# Altium schematic sheet ACD_SPD01_SPDHarness.SchDoc
size Letter; DocumentNumber: ACD_SPD01_SPDHarness; SheetNumber: 1; SheetTotal: 1
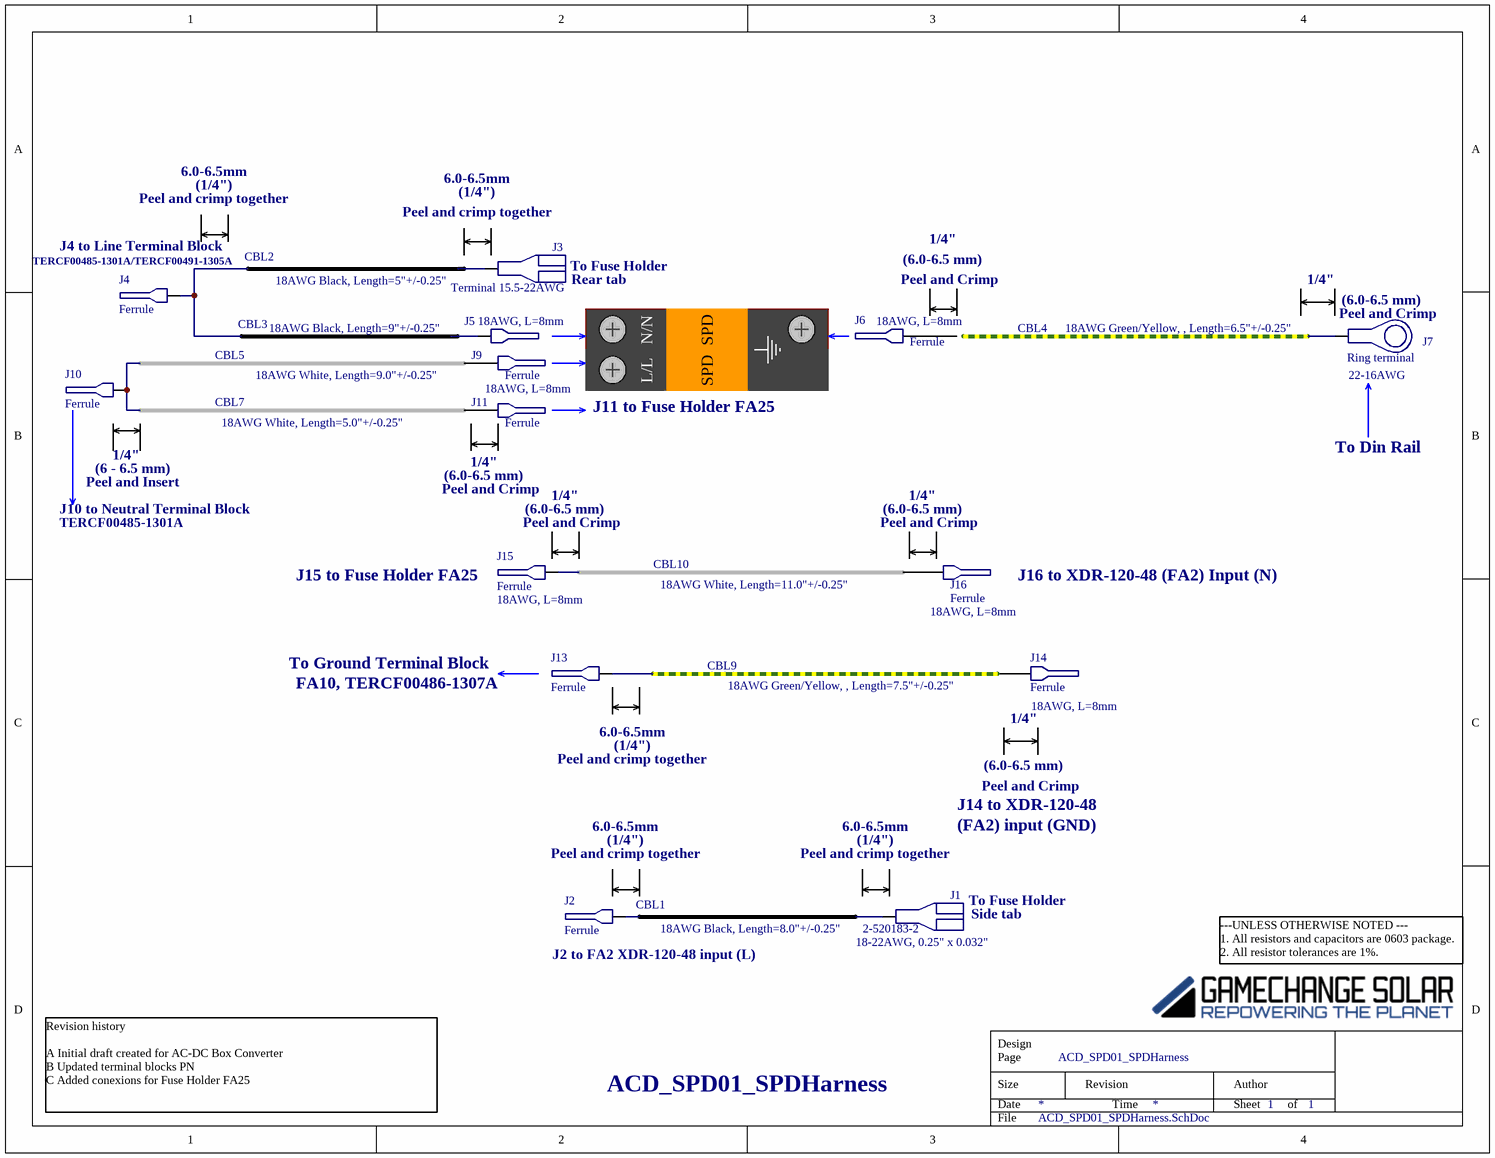
[diagram p0: ACD_SPD01_SPDHarness.SchDoc]

## Parts
CBL1  18AWG Black, Length=8.0"+/-0.25"  (mechanical)
CBL2  18AWG Black, Length=5"+/-0.25"  (mechanical)
CBL3  18AWG Black, Length=9"+/-0.25"  (mechanical)
CBL4  18AWG Green/Yellow, , Length=6.5"+/-0.25"  (mechanical)
CBL5  18AWG White, Length=9.0"+/-0.25"  (mechanical)
CBL7  18AWG White, Length=5.0"+/-0.25"  (mechanical)
CBL9  18AWG Green/Yellow, , Length=7.5"+/-0.25"  (mechanical)
CBL10  18AWG White, Length=11.0"+/-0.25"  (mechanical)
J1  2-520183-2  Package: 18-22AWG, 0.25" x 0.032"
J2  Ferrule
J3  Terminal 15.5-22AWG
J4  Ferrule
J5  Package: 18AWG, L=8mm  (hidden comment: Ferrule)
J6  Ferrule  Package: 18AWG, L=8mm
J7  Ring terminal  Package: 22-16AWG
J9  Ferrule
J10  Ferrule
J11  Ferrule  Package: 18AWG, L=8mm
J13  Ferrule
J14  Ferrule  Package: 18AWG, L=8mm
J15  Ferrule  Package: 18AWG, L=8mm
J16  Ferrule  Package: 18AWG, L=8mm

## Nets

Not connected (* = marked no-connect by the designer): J1 1(X); J2 1(X); J3 1(X); J4 1(X); J5 1(X); J6 1(X); J7 1(X); J9 1(X); J10 1(X); J11 1(X); J13 1(X); J14 1(X); J15 1(X); J16 1(X)

## Notes on the sheet
- 6.0-6.5mm
- Peel and crimp together
- (1/4")
- (near J4) TERCF00485-1301A/TERCF00491-1305A
- (near J4) J4 to Line Terminal Block
- Rear tab
- To Fuse Holder
- (6.0-6.5 mm)
- 1/4"
- (near J6) Peel and Crimp
- (near J7) 1/4"
- N/N
- L/L
- SPD
- (near J7) (6.0-6.5 mm)
- (near J7) Peel and Crimp
- J11 to Fuse Holder FA25
- Peel and Insert
- (6 - 6.5 mm)
- (near J11) 1/4"
- Peel and Crimp
- To Din Rail
- J10 to Neutral Terminal Block
- TERCF00485-1301A
- (near J15) Peel and Crimp
- (near J16) Peel and Crimp
- J15 to Fuse Holder FA25
- J16 to XDR-120-48 (FA2) Input (N)
- To Ground Terminal Block
- FA10, TERCF00486-1307A
- (near J13) 6.0-6.5mm
- (near J14) 1/4"
- J14 to XDR-120-48
- (FA2) input (GND)
- J2 to FA2 XDR-120-48 input (L)
- Side tab
- Revision history
  A Initial draft created for AC-DC Box Converter
  B Updated terminal blocks PN
  C Added conexions for Fuse Holder FA25
- Labels drawn without touching a wire or pin: GND
- ---UNLESS OTHERWISE NOTED ---
  1. All resistors and capacitors are 0603 package.
  2. All resistor tolerances are 1%.
- Design
- Size
- Date
- Page
- Revision
- Time
- Sheet
- Author
- of
- File

## Library data of the parts
CBL1-CBL3 = CBL,BLACK,18AWG: Hook-Up Wire, UL 1569, 18 AWG, Black; MFR1: Alpha Wire; MPN1: 891819 BK005; GCS PN: WIRHF00346-BK00A; Quantity: 1; MFR2: Open Source; MPN2: Open Source
CBL4 CBL9 = CBL,GREEN/YELLOW,18AWG: Hook-Up Wire, UL 1569, 18 AWG, Green, Yellow Stripe; MFR1: Alpha Wire; MPN1: 3055 GY005; GCS PN: WIRHF00439-GRYLA; Quantity: 1; MFR2: Open Source; MPN2: Open Source
CBL5 CBL7 CBL10 = CBL,WHITE,18AWG: Hook-Up Wire, UL 1569, 18 AWG, White; MFR1: Alpha Wire; MPN1: 891819 WH005; GCS PN: WIRHF00347-WH00A; Quantity: 1; MFR2: Open Source; MPN2: Open Source
J1 = HDR,1x1,w0.250,0.032, CBL,F: 0.250" (6.35mm) Quick Connect Female 18-22 AWG Crimp Connector Fully Insulated; MFR1: TE Connectivity AMP Connectors; GCS PN: TERCF00297-5201A; MPN1: 2-520183-2
J2 J5 J6 J9 J11 J14-J16 = HDR,1X1,Ferrule,Red: Red Wire Ferrule Connector 18 AWG Single Wire; MFR1: Phoenix Contact; MPN1: 3200904; Alternative source: free of choice; GCS PN: TERFF00379-1800A
  J2 J9: Package: 18AWG, L=8mm
J3 = HDR,1x1,w0.250,15.5-22AWG,F: 0.250" (6.35mm) Quick Connect Female 15.5-22 AWG Crimp Connector Non-Mating End Insulated; MFR1: TE Connectivity AMP Connectors; MPN1: 9-160583-2; GCS PN: TERCF00481-1522A
J4 J10 J13 = HDR,1X1,Ferrule,Gray: Gray Wire Ferrule Connector 12 AWG Single Wire; MFR1: Phoenix Contact; MPN1: 3200535; Alternative source: free of choice; GCS PN: TERFF00383-1200A; Package: 12AWG, L=10mm
J7 = Ring terminal_#6: Ring Terminal Connector 6 Stud Circular 16-22 AWG Crimp; MFR1: TE Connectivity AMP Connectors; MPN1: 130046; GCS PN: TERRF00307-1622A